# Altium schematic sheet MSub.SchDoc
size B; SheetNumber: 10; SheetTotal: 11
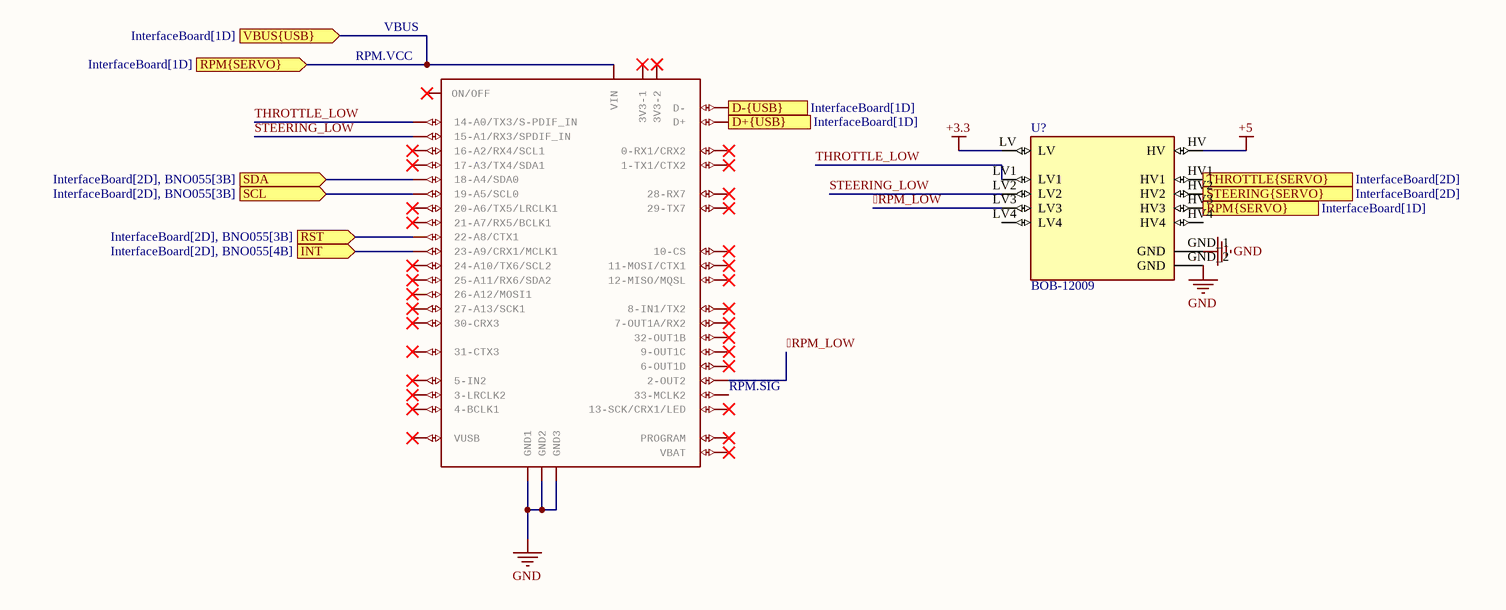
[diagram p0: MSub.SchDoc]

## Parts
U?  BOB-12009  [CONV_BOB-12009]
UM  Teensy 4.0 device including POGO pins for pins 24 - 33, but not yet pins for D+ and D-.  Symbol layout is what works for me and may not suite everyone... that can be added or additional symbols can be created to be used in a modilied davie name.  [TEENSY40]  (value not drawn)

## Ports
D+{USB} (in, see InterfaceBoard[1D]), D-{USB} (in, see InterfaceBoard[1D]), INT (in, see InterfaceBoard[2D], BNO055[4B]), RPM{SERVO} (in, see InterfaceBoard[1D]), RST (in, see InterfaceBoard[2D], BNO055[3B]), SCL (in, see InterfaceBoard[2D], BNO055[3B]), SDA (in, see InterfaceBoard[2D], BNO055[3B]), STEERING{SERVO} (in, see InterfaceBoard[2D]), THROTTLE{SERVO} (in, see InterfaceBoard[2D]), VBUS{USB} (in, see InterfaceBoard[1D])

## Nets
+3.3: U?.LV
+5: U?.HV
GND: U?.GND_1(GND) U?.GND_2(GND) UM.GND1 UM.GND2 UM.GND3
RPM_LOW: U?.LV3 UM.2-OUT2
D+{USB}: UM.D+ ; port D+{USB}
D-{USB}: UM.D- ; port D-{USB}
INT: UM.23-A9/CRX1/CCLK1(23-A9/CRX1/MCLK1) ; port INT
RPM{SERVO}: U?.HV3 UM.VIN ; port VBUS{USB}, port RPM{SERVO}
RST: UM.22-A8/CTX1 ; port RST
SCL: UM.19-A5/SCL0 ; port SCL
SDA: UM.18-A4/SDA0 ; port SDA
STEERING_LOW: U?.LV2 UM.15-A1/RX3/S-PDIF_IN(15-A1/RX3/SPDIF_IN)
STEERING{SERVO}: U?.HV2 ; port STEERING{SERVO}
THROTTLE_LOW: U?.LV1 UM.14-A0/TX3/S-PFI_OUT(14-A0/TX3/S-PDIF_IN)
THROTTLE{SERVO}: U?.HV1 ; port THROTTLE{SERVO}

Not connected (* = marked no-connect by the designer): U? HV4 LV4; UM 0-RX1(0-RX1/CRX2)* 1-TX1(1-TX1/CTX2)* 3-LRCLK2* 3V3-1* 3V3-2* 4-BCLK2(4-BCLK1)* 5-IN2* 6-OUT1D* 7-RX2/OUT1A(7-OUT1A/RX2)* 8-TX2/IN1(8-IN1/TX2)* 9-OUT1C* 10-CS/MQSR(10-CS)* 11-MOSI/CTX1* 12-MIO/MQSL(12-MISO/MQSL)* 13-SCK/CRX1/LED* 16-A2/RX4/SCL1* 17-A3/TX4/SDA1* 20-A6/TX5/LRCLK1* 21-A7/RX5/BCLK1* 24-A10/TX6/SCL2* 25-A11/SDA2(25-A11/RX6/SDA2)* 26-A12/MOSI1* 27-A13/SCK1* 28-RX7* 29-TX7* 30-CRX3* 31-CTX3* 32-OUTB1(32-OUT1B)* 33-MCLK2 ON/OFF* PROGRAM* VBAT* VUSB*

## Notes on the sheet
- (near UM) RPM.VCC
- (near UM) VBUS
- (near UM) RPM.SIG

## Library data of the parts
U? = CMP-030-000000-1: BSS138 - Logic-Level Translator Interface Evaluation Board; MF: SparkFun; SnapEDA_Link: https://www.snapeda.com/parts/BOB-12009/SparkFun/view-part/?ref=snap; Component Type: Standard; Source: BOB-12009.SchLib; Pin Count: 12; Check_prices: https://www.snapeda.com/parts/BOB-12009/SparkFun/view-part/?ref=eda; Value: *; MP: BOB-12009; Design Item ID: BOB-12009; Package: None
UM = TEENSY40: GateName_1: G$1; SymbolName_1: TEENSY40; LibraryName: TEENSYV1; DeviceSetName: TEENSY40; Package: TEENSY40